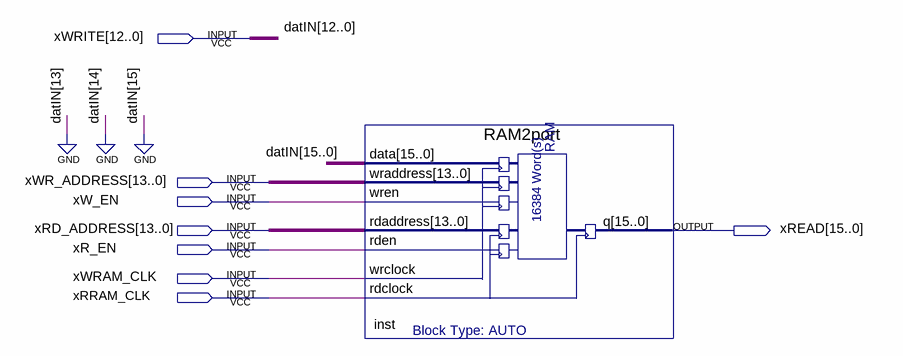
[diagram p0: schematic sheet]
// Quartus schematic RAM_16bit.bdf as structural Verilog: 1 symbols, 8 pins
module RAM_16bit (
  input  [12:0] xWRITE,
  input  [13:0] xWR_ADDRESS,
  input  xW_EN,
  input  [13:0] xRD_ADDRESS,
  input  xR_EN,
  input  xWRAM_CLK,
  input  xRRAM_CLK,
  output [15:0] xREAD
);

  RAM2port inst (
    .data({3'b000, xWRITE}), .wraddress(xWR_ADDRESS), .wren(xW_EN), .rdaddress(xRD_ADDRESS), .rden(xR_EN),
    .wrclock(xWRAM_CLK), .rdclock(xRRAM_CLK), .q(xREAD));

  // Other names for the same wires on the sheet: datIN[12:0] = xWRITE
endmodule
